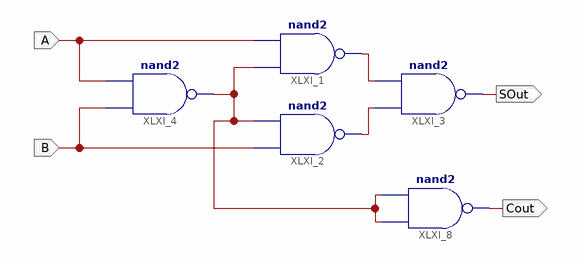
[diagram p0: schematic sheet 1]
// Xilinx ISE schematic HalfAdder_NAND.sch (spartan3e) as structural Verilog: 5 symbols, 4 ports
module HalfAdder_NAND (
  input  B,
  input  A,
  output SOut,
  output Cout
);

  wire XLXN_10, XLXN_16, XLXN_18;

  nand XLXI_3 (SOut, XLXN_18, XLXN_16);
  nand XLXI_4 (XLXN_10, B, A);
  nand XLXI_1 (XLXN_16, XLXN_10, A);
  nand XLXI_2 (XLXN_18, B, XLXN_10);
  nand XLXI_8 (Cout, XLXN_10, XLXN_10);
endmodule
